# Altium project project4_v1.PrjPcb
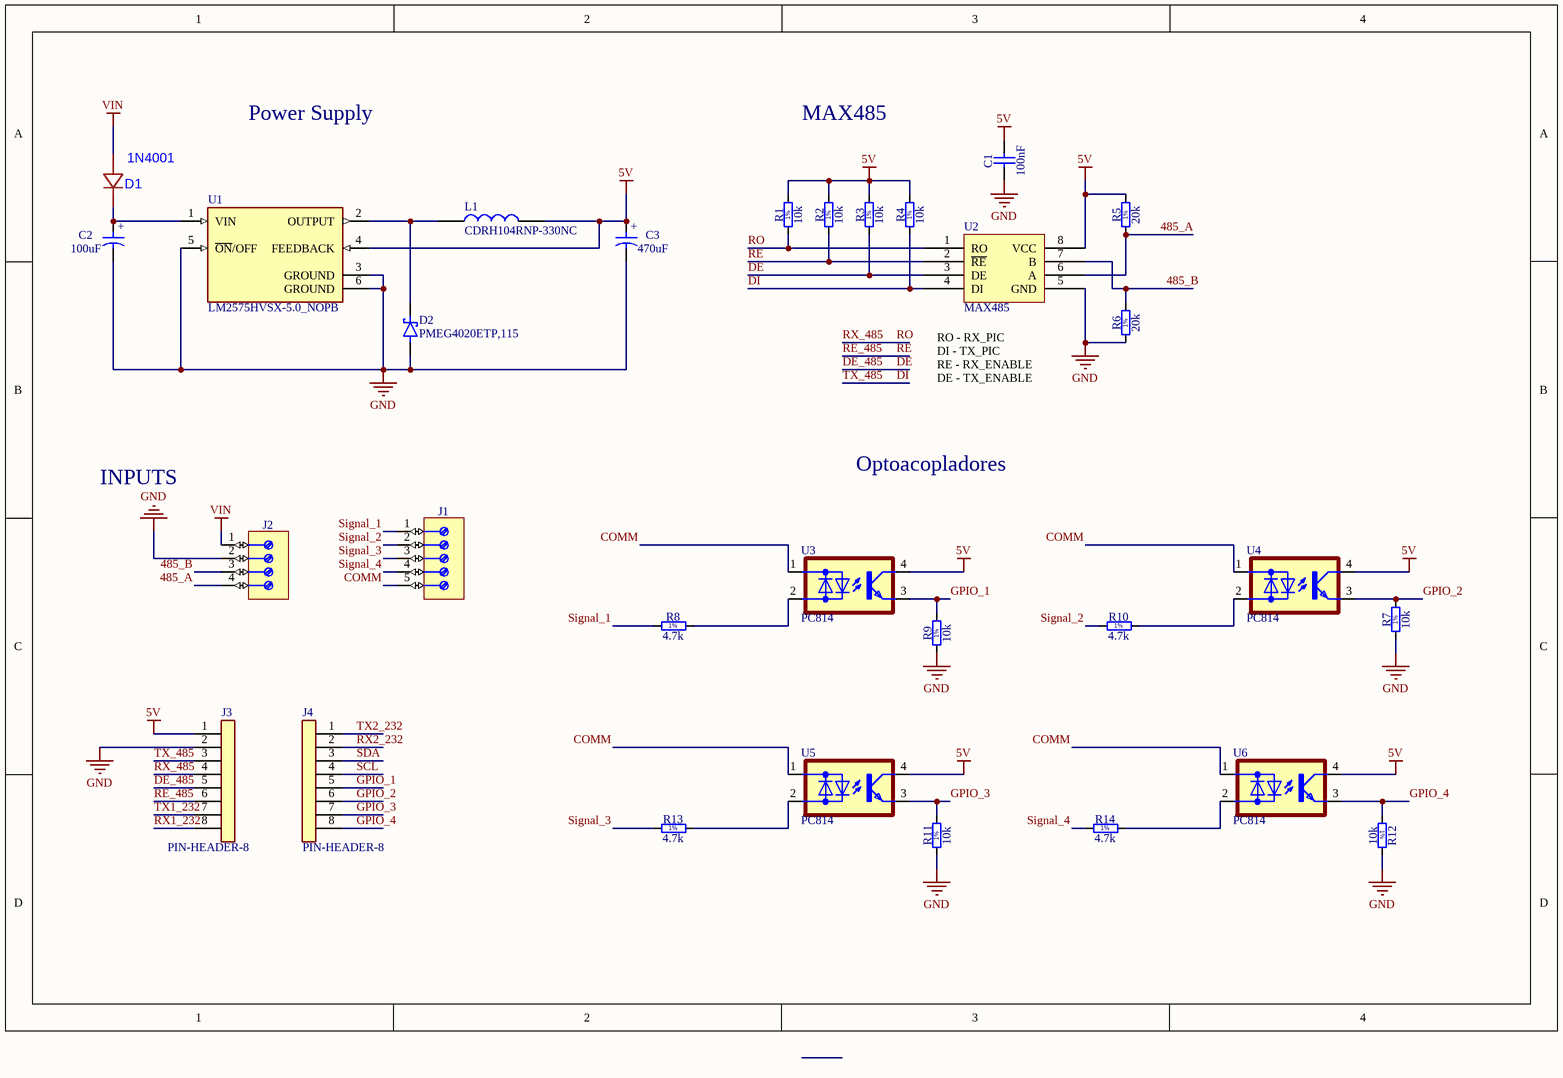
[diagram p0: project4_v1.SchDoc]
1 sheet, 30 parts. Net scope: global (net labels, ports and power ports of the same name join across sheets).
Board file: project4_v1.PcbDoc

## Sheet project4_v1.SchDoc
size A4; SheetNumber: 1; SheetTotal: 1

### Parts
C1  100nF  [CAPC2012X135N]
C2  100uF  [CAPAE830X1020N]
C3  470uF  [CAPAE1030X1020N]
D1  1N4001  [SMA_L4.5-W2.7-LS5.2-RD]
D2  PMEG4020ETP,115  [SODFL4725X110N]
J1  TRT5  [TRT_5_3.81_PLUG]  (value not drawn)
J2  TRT4  [TRT_4_3.81_PLUG]  (value not drawn)
J3  PIN-HEADER-8  [PIN-HEADER-8-FEMALE]
J4  PIN-HEADER-8  [PIN-HEADER-8-FEMALE]
L1  CDRH104RNP-330NC  [IND-SMD_L10.2-W10.0]
R1  10k  [RESC2012X60N]
R2  10k  [RESC2012X60N]
R3  10k  [RESC2012X60N]
R4  10k  [RESC2012X60N]
R5  20k  [RESC2012X60N]
R6  20k  [RESC2012X60N]
R7  10k  [RESC2012X60N]
R8  4.7k  [RESC2012X60N]
R9  10k  [RESC2012X60N]
R10  4.7k  [RESC2012X60N]
R11  10k  [RESC2012X60N]
R12  10k  [RESC2012X60N]
R13  4.7k  [RESC2012X60N]
R14  4.7k  [RESC2012X60N]
U1  LM2575HVSX-5.0_NOPB  [TO-263-5_L10.0-W8.4-P1.70-LS15.3-BR]
U2  MAX485  [SOIC8-N_MC]
U3  PC814  [PC814BS]
U4  PC814  [PC814BS]
U5  PC814  [PC814BS]
U6  PC814  [PC814BS]

### Nets
5V: C1.2 C3.1 J3.1 L1.2 R1.2 R2.2 R3.2 R4.2 R5.2 U1.4(FEEDBACK) U2.8(VCC) U3.4(C) U4.4(C) U5.4(C) U6.4(C)
GND: C1.1 C2.2 C3.2 D2.2(A) J2.2 J3.2 R6.1 R7.1 R9.1 R11.1 R12.2 U1.3(GROUND) U1.5(~{ON}/OFF) U1.6(GROUND) U2.5(GND)
VIN: D1.2(A) J2.1
485_A: J2.4 R5.1 U2.6(A)
485_B: J2.3 R6.2 U2.7(B)
COMM: J1.5 U3.1(AC1) U4.1(AC1) U5.1(AC1) U6.1(AC1)
DE: J3.5 R3.1 U2.3(DE)  [also labelled DE_485]
DI: J3.3 R4.1 U2.4(DI)  [also labelled TX_485]
GPIO_1: J4.5 R9.2 U3.3(E)
GPIO_2: J4.6 R7.2 U4.3(E)
GPIO_3: J4.7 R11.2 U5.3(E)
GPIO_4: J4.8 R12.1 U6.3(E)
RE: J3.6 R2.1 U2.2(~{RE})  [also labelled RE_485]
RO: J3.4 R1.1 U2.1(RO)  [also labelled RX_485]
RX1_232: J3.8
RX2_232: J4.2
SCL: J4.4
SDA: J4.3
Signal_1: J1.1 R8.1
Signal_2: J1.2 R10.1
Signal_3: J1.3 R13.1
Signal_4: J1.4 R14.1
TX1_232: J3.7
TX2_232: J4.1
NetC2_1: C2.1 D1.1(K) U1.1(VIN)
NetD2_1: D2.1(K) L1.1 U1.2(OUTPUT)
NetR8_2: R8.2 U3.2(AC2)
NetR10_2: R10.2 U4.2(AC2)
NetR13_2: R13.2 U5.2(AC2)
NetR14_2: R14.2 U6.2(AC2)

### Notes on the sheet
- Power Supply
- MAX485
- (near U2) RO - RX_PIC
  DI - TX_PIC
  RE - RX_ENABLE
  DE - TX_ENABLE
- INPUTS
- Optoacopladores
- (in symbol CAE830-1020_100UF_35V_20%) +
- (in symbol CAE1030-1020_470UF_25V_20%) +
- (in symbol R0805_10K_1%_0.125W_100PPM) 1%
- (in symbol R0805_20K_1%_0.125W_100PPM) 1%

### Library data of the parts
C1 = CC0805_100NF_50V_10%_X7R: Non-polarised capacitor; Part Description: SMD Multilayer Chip Ceramic Capacitor; Manufacturer: GENERIC; Manufacturer1 Part Number: B37941K5104K62; Voltage: 50V; TC: X7R; Tolerance: ±10%; Table: Capacitors SMD; Part Number: CC0805_100NF_50V_10%_X7R; Component Kind: Standard; Component Type: Standard; Pin Count: 2; Value: 100nF; Status: Preferred; Manufacturer Part Number: CC0805_100NF_50V_10%_X7R; Case: 0805; Mounted: Yes; Socket: No; SMD: Yes; Manufacturer1 Example: EPCOS; Manufacturer1 ComponentHeight: 1.35mm; HelpURL: \\cern.ch\dfs\Applications\Altium\Datasheets\CC0805_X7R_EPCOS.pdf; Author: CERN DEM JLC; CreateDate: 03/12/2007; LatestRevisionDate: 03/12/2007
C2 = CAE830-1020_100UF_35V_20%: Polarised capacitor; Part Description: Aluminum Electrolytic SMT Capacitor; Manufacturer: GENERIC; Manufacturer1 Part Number: EEEFK1V101AP; Voltage: 35V; Tolerance: ±20%; Table: Capacitors SMD; Part Number: CAE830-1020_100UF_35V_20%; Component Kind: Standard; Component Type: Standard; Pin Count: 2; Value: 100uF; Status: Not Recommended; Manufacturer Part Number: CAE830-1020_100UF_35V_20%; Case: F; Mounted: Yes; Socket: No; SMD: Yes; Manufacturer1 Example: PANASONIC; Manufacturer1 ComponentHeight: 10.2mm; HelpURL: \\cern.ch\dfs\Applications\Altium\Datasheets\CAE_PANASONIC_FK.pdf; Author: CERN DEM JLC; CreateDate: 3/12/2007; LatestRevisionDate: 3/12/2007
C3 = CAE1030-1020_470UF_25V_20%: Polarised capacitor; Part Description: Aluminum Electrolytic SMT Capacitor; Manufacturer: GENERIC; Manufacturer1 Part Number: EEEFK1E471AP; Voltage: 25V; Tolerance: ±20%; Table: Capacitors SMD; Part Number: CAE1030-1020_470UF_25V_20%; Component Kind: Standard; Component Type: Standard; Pin Count: 2; Value: 470uF; Status: Not Recommended; Manufacturer Part Number: CAE1030-1020_470UF_25V_20%; Case: G; Mounted: Yes; Socket: No; SMD: Yes; Manufacturer1 Example: PANASONIC; Manufacturer1 ComponentHeight: 10.2mm; HelpURL: \\cern.ch\dfs\Applications\Altium\Datasheets\CAE_PANASONIC_FK.pdf; Author: CERN DEM JLC; CreateDate: 3/12/2007; LatestRevisionDate: 3/12/2007
D1 = 1N4001 M1: Manufacturer: JSMSEMI(杰盛微); Add into BOM: yes; Diode Configuration: Independent; Voltage - Forward(Vf@If): 1V@1A; Voltage - DC Reverse(Vr): 50V; Current - Rectified: 1A; Reverse Leakage Current (Ir): 5uA@50V; Operating Junction Temperature Range: -55℃~+150℃; Symbol: 1N4001 M1; Device: 1N4001 M1; LCSC Part Name: 50V 1A; Supplier Part: C20754789; Manufacturer Part: 1N4001 M1; Supplier Footprint: SMA; JLCPCB Part Class: Extended Part; Datasheet: https://item.szlcsc.com/datasheet/1N4001%2520M1/22168790.html; Supplier: LCSC; Convert to PCB: yes
D2 = PMEG4020ETP,115: Diode Schottky 40V 2A Surface Mount SOD-128/CFP5; MF: Nexperia USA; SnapEDA_Link: https://www.snapeda.com/parts/PMEG4020ETP,115/Nexperia/view-part/?ref=snap; Package: CFP5-2 Nexperia USA Inc.; Value: *; MP: PMEG4020ETP,115; Check_prices: https://www.snapeda.com/parts/PMEG4020ETP,115/Nexperia/view-part/?ref=eda
J1 = TRT_5
J2 = TRT_4
J3 J4 = PIN-HEADER-8: MP: MTSW-108-07-G-S-208; Availability: Unavailable; Value: *; Price: None; Package: None
L1 = CDRH104RNP-330NC: Power Inductors - SMD 33uH 2.2A,33 H Shielded Inductor 2.2 A 93mOhm Max Nonstandard; Manufacturer_Name: Sumida; Geometry.Height: 4mm; Manufacturer_Part_Number: CDRH104RNP-330NC; Mouser Part Number: 851-CDRH104RNP-330NC; Mouser Price/Stock: https://www.mouser.co.uk/ProductDetail/Sumida/CDRH104RNP-330NC?qs=KlpbM3lUcZybZvlhH7RqIQ%3D%3D; Arrow Part Number: CDRH104RNP-330NC; Arrow Price/Stock: https://www.arrow.com/en/products/cdrh104rnp-330nc/sumida?region=nac; Datasheet Link: https://products.sumida.com/products/pdf/CDRH104R.pdf?t=1684247558
R1-R4 R7 R9 R11 R12 = R0805_10K_1%_0.125W_100PPM: Resistor - 1%; Part Description: General Purpose Thick Film Chip Resistor; Manufacturer: GENERIC; Manufacturer1 Part Number: NRC10F1002TRF; Power: 0.125W; TC: ±100ppm/°C; Table: Resistors SMD; Part Number: R0805_10K_1%_0.125W_100PPM; Component Kind: Standard; Component Type: Standard; Pin Count: 2; Value: 10k; Status: Preferred; Tolerance: ±1%; Manufacturer Part Number: R0805_10K_1%_0.125W_100PPM; Case: 0805; Mounted: Yes; Socket: No; SMD: Yes; Manufacturer1 Example: NIC COMPONENT; Manufacturer1 ComponentHeight: 0.6mm; HelpURL: \\cern.ch\dfs\Applications\Altium\Datasheets\R0805_NIC_NRC.pdf; Author: CERN DEM JLC; CreateDate: 03/12/2007; LatestRevisionDate: 13/03/2008
R5 R6 = R0805_20K_1%_0.125W_100PPM: Resistor - 1%; Part Description: General Purpose Thick Film Chip Resistor; Manufacturer: GENERIC; Manufacturer1 Part Number: NRC10F2002TRF; Power: 0.125W; TC: ±100ppm/°C; Table: Resistors SMD; Part Number: R0805_20K_1%_0.125W_100PPM; Component Kind: Standard; Component Type: Standard; Pin Count: 2; Value: 20k; Status: Preferred; Tolerance: ±1%; Manufacturer Part Number: R0805_20K_1%_0.125W_100PPM; Case: 0805; Mounted: Yes; Socket: No; SMD: Yes; Manufacturer1 Example: NIC COMPONENT; Manufacturer1 ComponentHeight: 0.6mm; HelpURL: \\cern.ch\dfs\Applications\Altium\Datasheets\R0805_NIC_NRC.pdf; Author: CERN DEM JLC; CreateDate: 03/12/2007; LatestRevisionDate: 13/03/2008
R8 R10 R13 R14 = R0805_10K_1%_0.125W_100PPM: Resistor - 1%; Part Description: General Purpose Thick Film Chip Resistor; Manufacturer: GENERIC; Manufacturer1 Part Number: NRC10F1002TRF; Value: 10k; Power: 0.125W; TC: ±100ppm/°C; Table: Resistors SMD; Part Number: R0805_10K_1%_0.125W_100PPM; Component Kind: Standard; Component Type: Standard; Pin Count: 2; Status: Preferred; Tolerance: ±1%; Manufacturer Part Number: R0805_10K_1%_0.125W_100PPM; Case: 0805; Mounted: Yes; Socket: No; SMD: Yes; Manufacturer1 Example: NIC COMPONENT; Manufacturer1 ComponentHeight: 0.6mm; HelpURL: \\cern.ch\dfs\Applications\Altium\Datasheets\R0805_NIC_NRC.pdf; Author: CERN DEM JLC; CreateDate: 03/12/2007; LatestRevisionDate: 13/03/2008
U1 = LM2575HVSX-5.0_NOPB: Buck Switching Regulator IC Positive Fixed 5V 1 Output 2A TO-263-6, D2PAK (5 Leads + Tab), TO-263BA; MF: UMW; MP: LM2575S-5.0; SnapEDA_Link: https://www.snapeda.com/parts/LM2575S-5.0/UMW/view-part/?ref=snap; Package: None; Value: *; Check_prices: https://www.snapeda.com/parts/LM2575S-5.0/UMW/view-part/?ref=eda
U3-U6 = PC814: Optoacoplador com saÃ­da de transistor de 5000Vrms, 1 canal, 4 componentes SMD.; MF: Essentra Components; SnapEDA_Link: https://www.snapeda.com/parts/PC814/Essentra/view-part/?ref=snap; Package: DIP-4 SHARP/Socle Technology; Value: *; MP: PC814; Check_prices: https://www.snapeda.com/parts/PC814/Essentra/view-part/?ref=eda